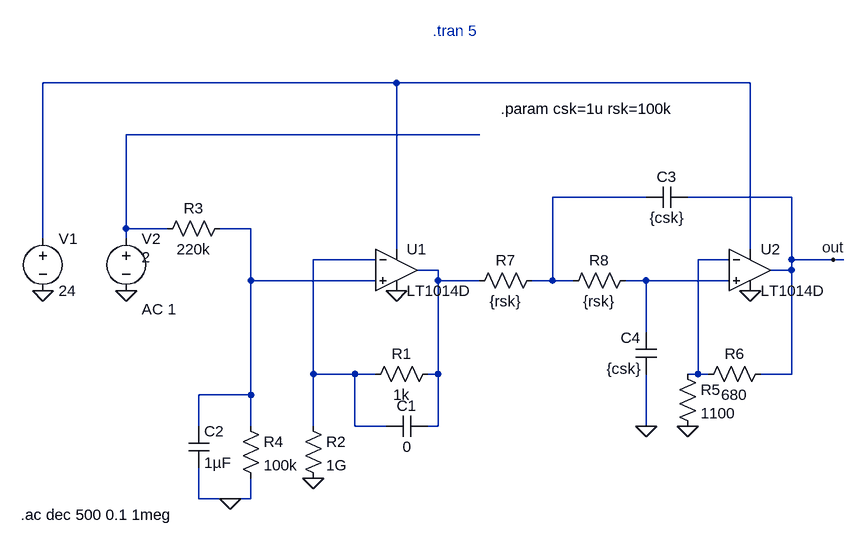
[diagram p0: schematic PHYS439-alpha-filter.asc]
PHYS439-alpha-filter.asc, the LTspice schematic file:
Version 4
SHEET 1 996 680
WIRE 288 -112 -256 -112
WIRE 832 -112 288 -112
WIRE 416 -32 -128 -32
WIRE 672 64 528 64
WIRE 896 64 736 64
WIRE -128 112 -128 -32
WIRE -64 112 -128 112
WIRE 64 112 16 112
WIRE -256 128 -256 -112
WIRE -128 128 -128 112
WIRE 288 144 288 -112
WIRE 832 144 832 -112
WIRE 256 160 160 160
WIRE 800 160 752 160
WIRE 896 160 896 64
WIRE 960 160 896 160
WIRE 976 160 960 160
WIRE 352 176 320 176
WIRE 896 176 896 160
WIRE 896 176 864 176
WIRE 64 192 64 112
WIRE 256 192 64 192
WIRE 352 192 352 176
WIRE 416 192 352 192
WIRE 528 192 528 64
WIRE 528 192 496 192
WIRE 560 192 528 192
WIRE 672 192 640 192
WIRE 800 192 672 192
WIRE 672 272 672 192
WIRE 160 336 160 160
WIRE 224 336 160 336
WIRE 256 336 224 336
WIRE 352 336 352 192
WIRE 352 336 336 336
WIRE 752 336 752 160
WIRE 752 336 736 336
WIRE 768 336 752 336
WIRE 896 336 896 176
WIRE 896 336 848 336
WIRE 64 368 64 192
WIRE 64 368 -16 368
WIRE -16 416 -16 368
WIRE 64 416 64 368
WIRE 160 416 160 336
WIRE 224 416 224 336
WIRE 272 416 224 416
WIRE 352 416 352 336
WIRE 352 416 336 416
WIRE 672 416 672 336
WIRE -16 528 -16 480
WIRE 32 528 -16 528
WIRE 64 528 64 496
WIRE 64 528 32 528
FLAG 288 208 0
FLAG -256 208 0
FLAG 832 208 0
FLAG -128 208 0
FLAG 160 496 0
FLAG 32 528 0
FLAG 736 416 0
FLAG 672 416 0
FLAG 960 160 out
SYMBOL Opamps\\LT1014D 288 112 R0
SYMATTR InstName U1
SYMBOL voltage -256 112 R0
WINDOW 123 0 0 Left 0
WINDOW 39 0 0 Left 0
SYMATTR InstName V1
SYMATTR Value 24
SYMBOL Opamps\\LT1014D 832 112 R0
SYMATTR InstName U2
SYMBOL voltage -128 112 R0
WINDOW 123 24 124 Left 2
WINDOW 39 0 0 Left 0
WINDOW 3 24 44 Left 2
SYMATTR Value2 AC 1
SYMATTR InstName V2
SYMATTR Value 2
SYMBOL res 352 320 R90
WINDOW 0 0 56 VBottom 2
WINDOW 3 32 56 VTop 2
SYMATTR InstName R1
SYMATTR Value 1k
SYMBOL cap 336 400 R90
WINDOW 0 0 32 VBottom 2
WINDOW 3 32 32 VTop 2
SYMATTR InstName C1
SYMATTR Value 0
SYMBOL res 144 400 R0
SYMATTR InstName R2
SYMATTR Value 1G
SYMBOL res 32 96 R90
WINDOW 0 0 56 VBottom 2
WINDOW 3 32 56 VTop 2
SYMATTR InstName R3
SYMATTR Value 220k
SYMBOL res 48 400 R0
SYMATTR InstName R4
SYMATTR Value 100k
SYMBOL cap -32 416 R0
SYMATTR InstName C2
SYMATTR Value 1µF
SYMBOL res 720 320 R0
SYMATTR InstName R5
SYMATTR Value 1100
SYMBOL res 864 320 R90
WINDOW 0 0 56 VBottom 2
WINDOW 3 32 56 VTop 2
SYMATTR InstName R6
SYMATTR Value 680
SYMBOL cap 736 48 R90
WINDOW 0 0 32 VBottom 2
WINDOW 3 32 32 VTop 2
SYMATTR InstName C3
SYMATTR Value {csk}
SYMBOL cap 688 336 R180
WINDOW 0 24 56 Left 2
WINDOW 3 24 8 Left 2
SYMATTR InstName C4
SYMATTR Value {csk}
SYMBOL res 512 176 R90
WINDOW 0 0 56 VBottom 2
WINDOW 3 32 56 VTop 2
SYMATTR InstName R7
SYMATTR Value {rsk}
SYMBOL res 656 176 R90
WINDOW 0 0 56 VBottom 2
WINDOW 3 32 56 VTop 2
SYMATTR InstName R8
SYMATTR Value {rsk}
TEXT 448 -72 Left 2 !.param csk=1u rsk=100k
TEXT -290 552 Left 2 !.ac dec 500 0.1 1meg
TEXT 344 -192 Left 2 ;.tran 5

The netlist it stands for:
* PHYS439-alpha-filter.asc
XU1 N004 N005 N001 0 N007 LT1014D  ; pins In+ In- V+ V- OUT
V1 N001 0 24
XU2 N008 N006 N001 0 out LT1014D  ; pins In+ In- V+ V- OUT
V2 N002 0 2 AC 1
R1 N007 N005 1k
C1 N007 N005 0
R2 N005 0 1G
R3 N004 N002 220k
R4 N004 0 100k
C2 N004 0 1µF
R5 N006 0 1100
R6 out N006 680
C3 out N003 {csk}
C4 0 N008 {csk}
R7 N003 N007 {rsk}
R8 N008 N003 {rsk}
.param csk=1u rsk=100k
.ac dec 500 0.1 1meg
* .tran 5
.backanno
.end